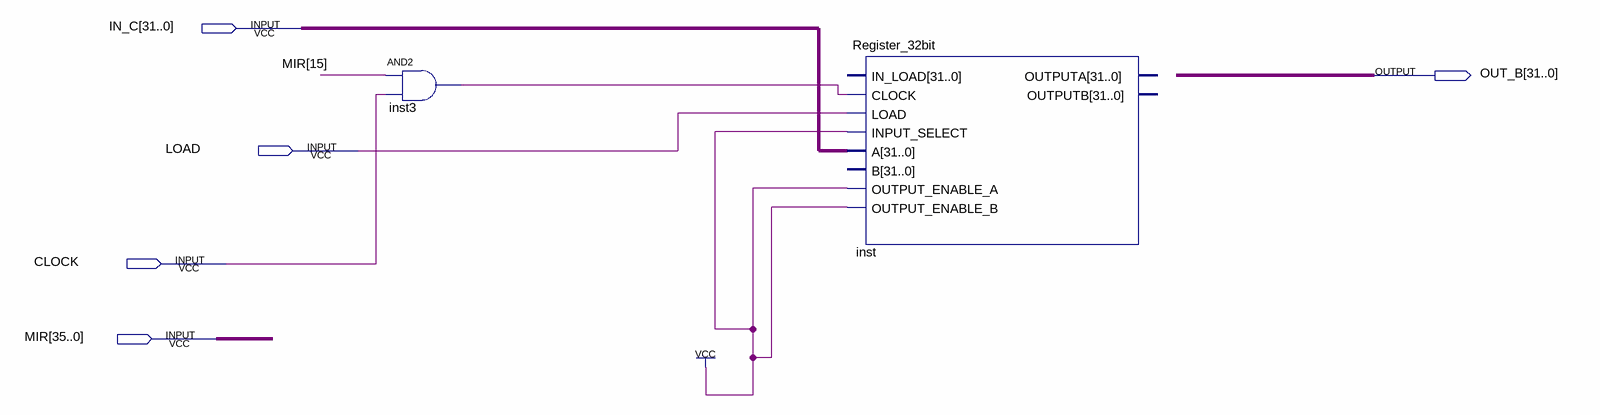
[diagram p0: schematic sheet]
// Quartus schematic H.bdf as structural Verilog: 2 symbols, 5 pins
module H (
  input  [31:0] IN_C,
  input  LOAD,
  input  CLOCK,
  input  [35:0] MIR,
  output [31:0] OUT_B
);

  wire inst3_out;

  and inst3 (inst3_out, MIR[15], CLOCK);
  Register_32bit inst (
    .CLOCK(inst3_out), .LOAD(LOAD), .INPUT_SELECT(1'b1), .A(IN_C), .OUTPUT_ENABLE_A(1'b1),
    .OUTPUT_ENABLE_B(1'b1));  // open: IN_LOAD, B, OUTPUTA, OUTPUTB
endmodule
